# Altium schematic sheet SAM_E54_Xplained_Pro_Memory.SchDoc: Memory
size A3; Organization: Microchip Norway; Address1: Vestre Rosten 79; Address2: N-7075 TILLER; Address3: NORWAY; DocumentNumber: A09-2748; Revision: 5; SheetNumber: 8; SheetTotal: 13; DrawnBy: Microchip Norway; Engineer: HN; PageSetup: Record=PageOptions|CenterHorizontal=True|CenterVertical=True|PrintScale=1.01|XCorrection=1.00|YCorrection=1.00|PrintKind=1|BorderSize=5000000|LeftOffset=0|BottomOffset=0|Orientation=2|PaperLength=1000|PaperWidth=1000|Scale=100|PaperSource=7|PrintQuality=-4|MediaType=1|DitherType=10|PaperKind=A3 (297 x 420 mm)|PrintScaleMode=1; ProjectTitle: SAM E54 Xplained Pro; PCBNumber: A08-2643; PCBRevision: 3; ProjectName: SAM E54 Xplained Pro
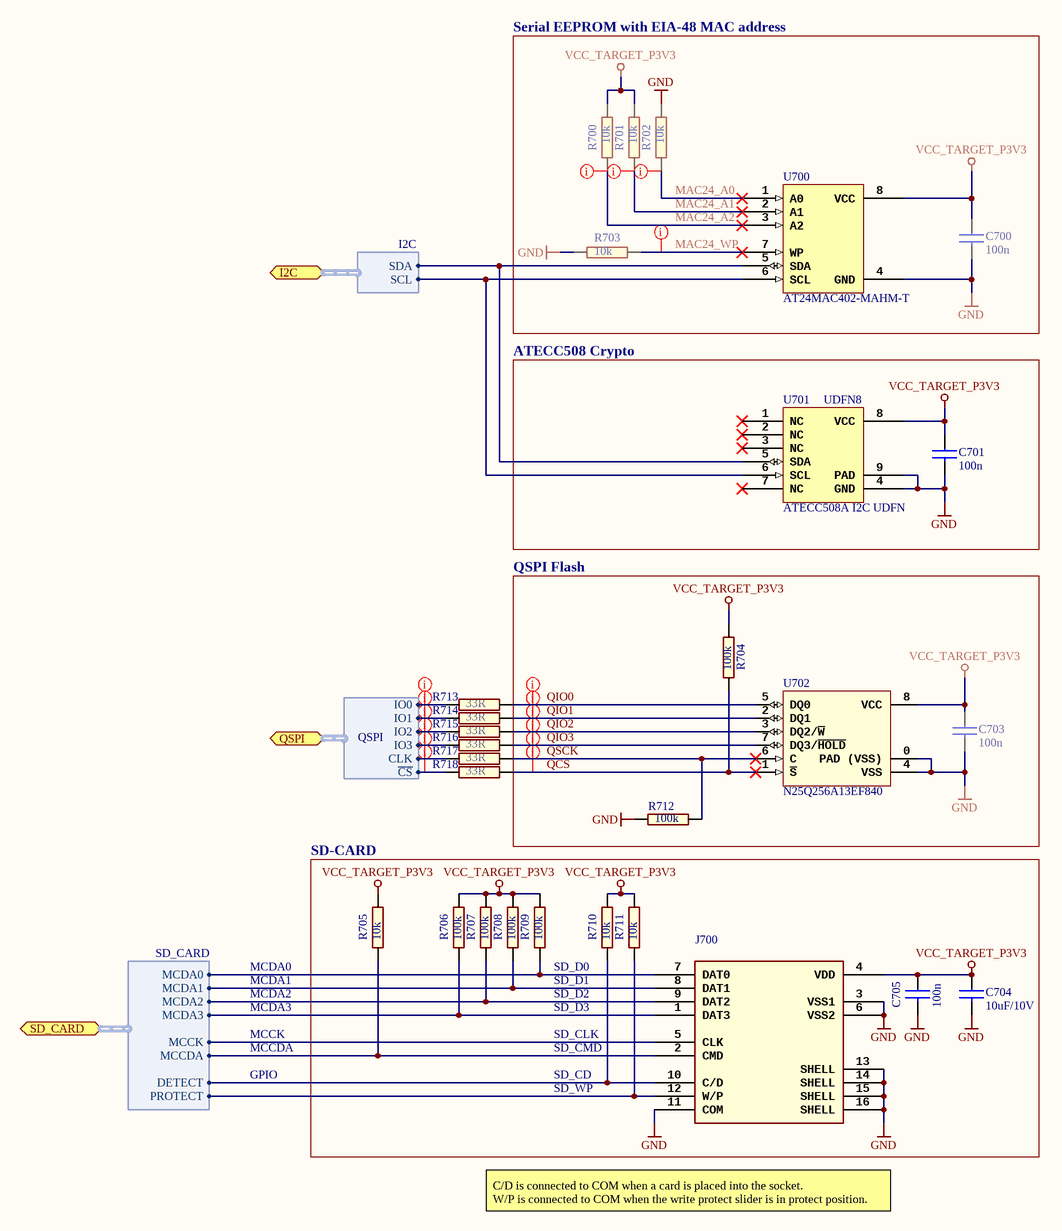
[diagram p0: SAM_E54_Xplained_Pro_Memory.SchDoc]

## Parts
C700  value 100n  [AP1-00053]
C701  value 100n  [AP1-00053]
C703  value 100n  [AP1-00053]
C704  value 10uF/10V  [AP1-00117]
C705  value 100n  [AP1-00053]
J700  (no value)  [AP8-00377]
R700  value 10k  [AP2-00011]
R701  value 10k  [AP2-00011]
R702  value 10k  [AP2-00011]
R703  value 10k  [AP2-00011]
R704  value 100k  [AP2-00011]
R705  value 10k  [AP2-00011]
R706  value 100k  [AP2-00011]
R707  value 100k  [AP2-00011]
R708  value 100k  [AP2-00011]
R709  value 100k  [AP2-00011]
R710  value 10k  [AP2-00011]
R711  value 10k  [AP2-00011]
R712  value 100k  [AP2-00011]
R713  value 33R  [AP2-00011]
R714  value 33R  [AP2-00011]
R715  value 33R  [AP2-00011]
R716  value 33R  [AP2-00011]
R717  value 33R  [AP2-00011]
R718  value 33R  [AP2-00011]
U700  value AT24MAC402-MAHM-T  [AP6-00186]
U701  value ATECC508A I2C UDFN  [AP6-00409]
U702  value N25Q256A13EF840  [AP6-00478]

## Blocks framed on the sheet
Serial EEPROM with EIA-48 MAC address: C700 R700-R703 U700
ATECC508 Crypto: C701 U701
QSPI Flash: C703 R704 R712 U702
SD-CARD: C704 C705 J700 R705-R711

## Ports
I2C (harness I2C), QSPI (harness QSPI), SD_CARD (harness SD_CARD)

## Harnesses
SD_CARD: MCCDA, MCCK, MCDA3, MCDA2, MCDA1, MCDA0, DETECT, PROTECT
QSPI: CLK, IO3, IO2, IO0, IO1, ~{CS}
I2C: SDA, SCL

## Nets
GND: C700.2 C701.2 C703.2 C704.2 C705.2 J700.3(VSS1) J700.6(VSS2) J700.11(COM) J700.13(SHELL) J700.14(SHELL) J700.15(SHELL) J700.16(SHELL) R702.2 R703.1 R712.1 U700.4(GND) U701.4(GND) U701.9(PAD) U702.0(PAD_(VSS)) U702.4(VSS)
VCC_TARGET_P3V3: C700.1 C701.1 C703.1 C704.1 C705.1 J700.4(VDD) R700.2 R701.2 R704.2 R705.2 R706.2 R707.2 R708.2 R709.2 R710.2 R711.2 U700.8(VCC) U701.8(VCC) U702.8(VCC)
MAC24_A0: R702.1 U700.1(A0)
MAC24_A1: R701.1 U700.2(A1)
MAC24_A2: R700.1 U700.3(A2)
MAC24_WP: R703.2 U700.7(WP)
QCS: R704.1 R718.1 U702.1(~{S})
QIO0: R713.1 U702.5(DQ0)
QIO1: R714.1 U702.2(DQ1)
QIO2: R715.1 U702.3(DQ2/~{W})
QIO3: R716.1 U702.7(DQ3/~{HOLD})
QSCK: R712.2 R717.1 U702.6(C)
NetJ700_1: J700.1(DAT3) R706.1 ; port SD_CARD.MCDA3
NetJ700_2: J700.2(CMD) R705.1 ; port SD_CARD.MCCDA
NetJ700_5: J700.5(CLK) ; port SD_CARD.MCCK
NetJ700_7: J700.7(DAT0) R709.1 ; port SD_CARD.MCDA0
NetJ700_8: J700.8(DAT1) R708.1 ; port SD_CARD.MCDA1
NetJ700_9: J700.9(DAT2) R707.1 ; port SD_CARD.MCDA2
NetJ700_10: J700.10(C/D) R710.1 ; port SD_CARD.DETECT
NetJ700_12: J700.12(W/P) R711.1 ; port SD_CARD.PROTECT
NetR713_2: R713.2 ; port QSPI.IO0
NetR714_2: R714.2 ; port QSPI.IO1
NetR715_2: R715.2 ; port QSPI.IO2
NetR716_2: R716.2 ; port QSPI.IO3
NetR717_2: R717.2 ; port QSPI.CLK
NetR718_2: R718.2 ; port QSPI.~{CS}
NetU700_5: U700.5(SDA) U701.5(SDA) ; port I2C.SDA
NetU700_6: U700.6(SCL) U701.6(SCL) ; port I2C.SCL

Not connected (* = marked no-connect by the designer): U701 1(NC)* 2(NC)* 3(NC)* 7(NC)*

## Layout directives
rule Assembly Testpoint Usage [Testpoint - Not Allowed    Multiple - Not Allowed]; rule Fabrication Testpoint Usage [Testpoint - Not Allowed    Multiple - Not Allowed]: MAC24_A0, MAC24_A1, MAC24_A2, MAC24_WP
net class QSPI: QCS, QIO0, QIO1, QIO2, QIO3, QSCK
rule Assembly Testpoint Usage [Testpoint - Not Allowed    Multiple - Not Allowed]; rule Fabrication Testpoint Usage [Testpoint - Not Allowed    Multiple - Not Allowed]; net class QSPI_MCU: NetR713_2, NetR714_2, NetR715_2, NetR716_2, NetR717_2, NetR718_2

## Notes on the sheet
- (near U701) UDFN8
- MCDA0
- MCDA1
- MCDA2
- MCDA3
- SD_D0
- SD_D1
- SD_D2
- SD_D3
- GPIO
- MCCK
- MCCDA
- SD_CLK
- SD_CMD
- SD_CD
- SD_WP
- C/D is connected to COM when a card is placed into the socket.
  W/P is connected to COM when the write protect slider is in protect position.
- Drawn By:
- Project Title
- Engineer:
- Designed with
- Sheet Title
- Size
- A3
- PCB Number:
- PCB Assembly Number:
- PCBA Revision:
- PCB    Revision:
- Date:
- Altium.com <http://go.altium.com/MicrochipLandingPage_Evaluation.html>
- File:
- Page:

## Library data of the parts
C700 C701 C703 C705 = A01-0246: Ceramic capacitor, SMD 0402, X7R, 16V, +/-10%; PartGroup: Capacitors,Ceramic,SMD 0402; Manufacturer: Kemet; MPN: C0402C104K4RACTU; TemperatureRange: -55 - +125 deg C; AN: A01-0246; Tolerance: 16V, +/-10%; Height: 0,5
C704 = A01-0461: Ceramic capacitor, SMD 0603, X5R, 10V, 10UF Â± 20%; PartGroup: Capacitors,Ceramic,SMD 0603; Manufacturer: AVX; MPN: 0603ZD106MAT2A; Tolerance: Â± 20%; TemperatureRange: -55Â°C to +85Â°C; AN: A01-0461
J700 = A08-0816: SD/MMC socket, 2.7mm, push-push, SMD; PartGroup: Mechanical devices,Connectors,Memory cards; Manufacturer: Kyocera-elco; Value: KYOCERA - 14 5738 009 220 859+; TemperatureRange: -25 deg C to 90 deg C; AN: A08-0816; Height: 2,70000004768372; MPN: KYOCERA - 14 5738 009 220 859+
R700-R703 R705 R710 R711 = A02-0236: Thick film resistor, SMD 0402, 1/16W, 1%; PartGroup: Resistors,SMD,0402 1%; Manufacturer: vishay; MPN: CRCW040210K0FKED; TemperatureRange: -55 - +125 deg C; AN: A02-0236; Tolerance: 1 %; Height: 0,349999994039536
R704 R706-R709 R712 = A02-0260: Thick film resistor, SMD 0402, 1/16W, 1%; PartGroup: Resistors,SMD,0402 1%; Manufacturer: ASJ; MPN: CR10-1003-FK; TemperatureRange: -55ï¿½ to +125ï¿½C; AN: A02-0260; Tolerance: 1 %; Height: 0,349999994039536
R713-R718 = A02-0176: Thick film resistor, SMD 0402, 1/16W, 1%; PartGroup: Resistors,SMD,0402 1%; Manufacturer: ASJ; MPN: CR10-33R0-FK; TemperatureRange: -55 - +125 deg C; AN: A02-0176; Tolerance: 1 %; Height: 0,349999994039536
U700 = A06-1169: 2kbit I2C EEPROM, single EUI-48 MAC, 1.7-5.5V, 2x3mm UDFN (8MA2); PartGroup: Integrated Circuits,Memory,EEPROM; Manufacturer: ATMEL; TemperatureRange: â€“40Â°C to +85Â°C; AN: A06-1169; Height: 0,600000023841858; MPN: AT24MAC402-MAHM-T
U701 = A06-1281: ATECC508A with an I2C Interface and a 8 Pin UDFN Package with Paddle; PartGroup: Integrated Circuits,Special function,Encryption; Manufacturer: MICROCHIP; MPN: ATECC508A-MAHDA-T; AN: A06-1281; Height: 0,600000023841858
U702 = A06-1459: 256 Mbit (32MB) QSPI flash, 3.3V, 108MHz, V-PDFN-8 (8x6mm); PartGroup: Integrated Circuits,Memory,FLASH; Manufacturer: Micron; MPN: N25Q256A13EF840F; TemperatureRange: â€“40Â°C to 85Â°C; AN: A06-1459; Height: 0,850000023841858